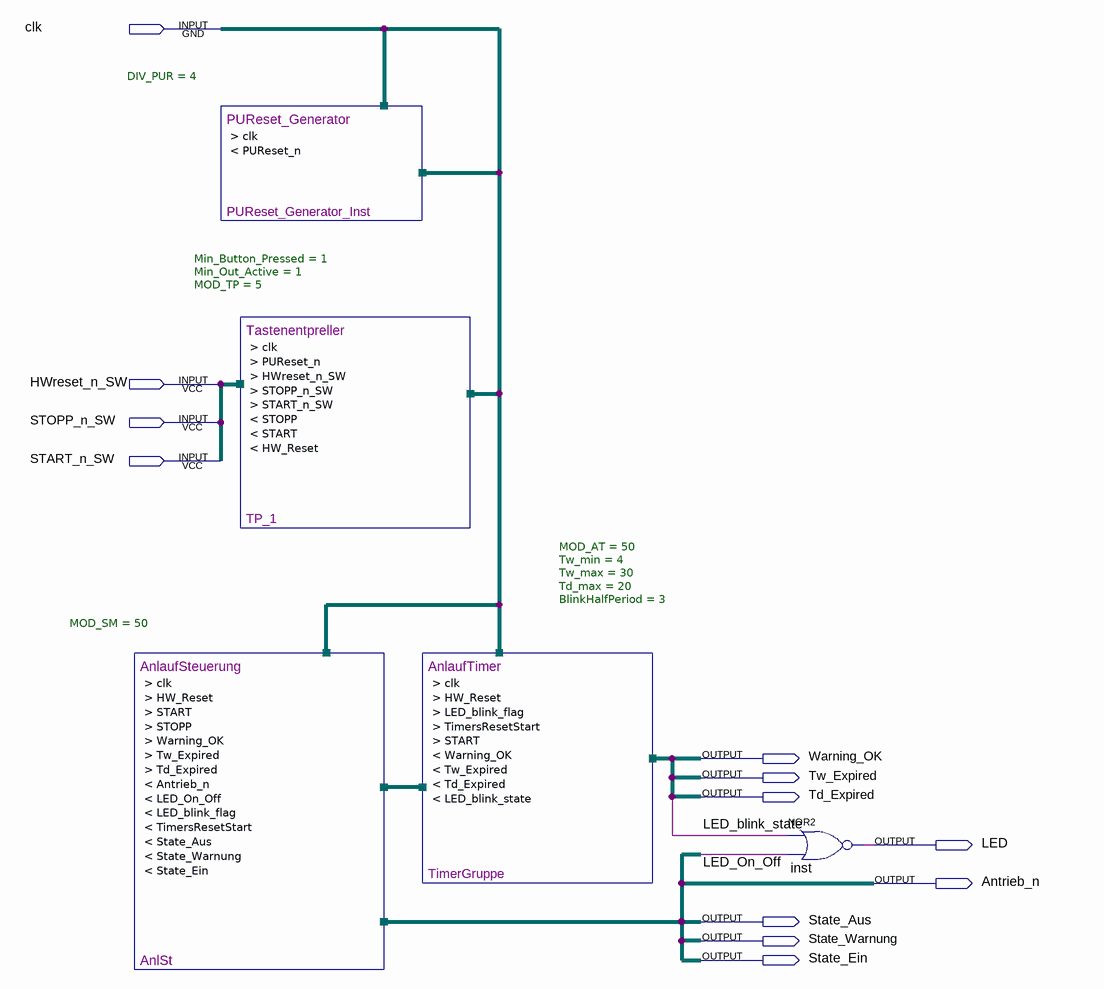
[diagram p0: schematic sheet]
// Quartus schematic CA2_SM.bdf as structural Verilog: 5 symbols, 12 pins
module CA2_SM (
  input  clk,
  input  HWreset_n_SW,
  input  STOPP_n_SW,
  input  START_n_SW,
  output Warning_OK,
  output Tw_Expired,
  output Td_Expired,
  output LED,
  output Antrieb_n,
  output State_Aus,
  output State_Warnung,
  output State_Ein
);

  wire HW_Reset, LED_blink_flag, LED_blink_state, LED_On_Off, PUReset_n, START, STOPP, TimersResetStart;

  AnlaufSteuerung #(.MOD_SM(50)) AnlSt (
    .clk(clk), .HW_Reset(HW_Reset), .START(START), .STOPP(STOPP), .Warning_OK(Warning_OK),
    .Tw_Expired(Tw_Expired), .Td_Expired(Td_Expired), .Antrieb_n(Antrieb_n), .LED_On_Off(LED_On_Off),
    .LED_blink_flag(LED_blink_flag), .TimersResetStart(TimersResetStart), .State_Aus(State_Aus),
    .State_Warnung(State_Warnung), .State_Ein(State_Ein));
  PUReset_Generator #(.DIV_PUR(4)) PUReset_Generator_Inst (.clk(clk), .PUReset_n(PUReset_n));
  Tastenentpreller #(.Min_Button_Pressed(1), .Min_Out_Active(1), .MOD_TP(5)) TP_1 (
    .clk(clk), .PUReset_n(PUReset_n), .HWreset_n_SW(HWreset_n_SW), .STOPP_n_SW(STOPP_n_SW),
    .START_n_SW(START_n_SW), .STOPP(STOPP), .START(START), .HW_Reset(HW_Reset));
  AnlaufTimer #(.MOD_AT(50), .Tw_min(4), .Tw_max(30), .Td_max(20), .BlinkHalfPeriod(3)) TimerGruppe (
    .clk(clk), .HW_Reset(HW_Reset), .LED_blink_flag(LED_blink_flag), .TimersResetStart(TimersResetStart),
    .START(START), .Warning_OK(Warning_OK), .Tw_Expired(Tw_Expired), .Td_Expired(Td_Expired),
    .LED_blink_state(LED_blink_state));
  nor inst (LED, LED_blink_state, LED_On_Off);
endmodule
